# Altium schematic sheet 4_IMU.SchDoc
size A4; SheetNumber: 6; SheetTotal: 7
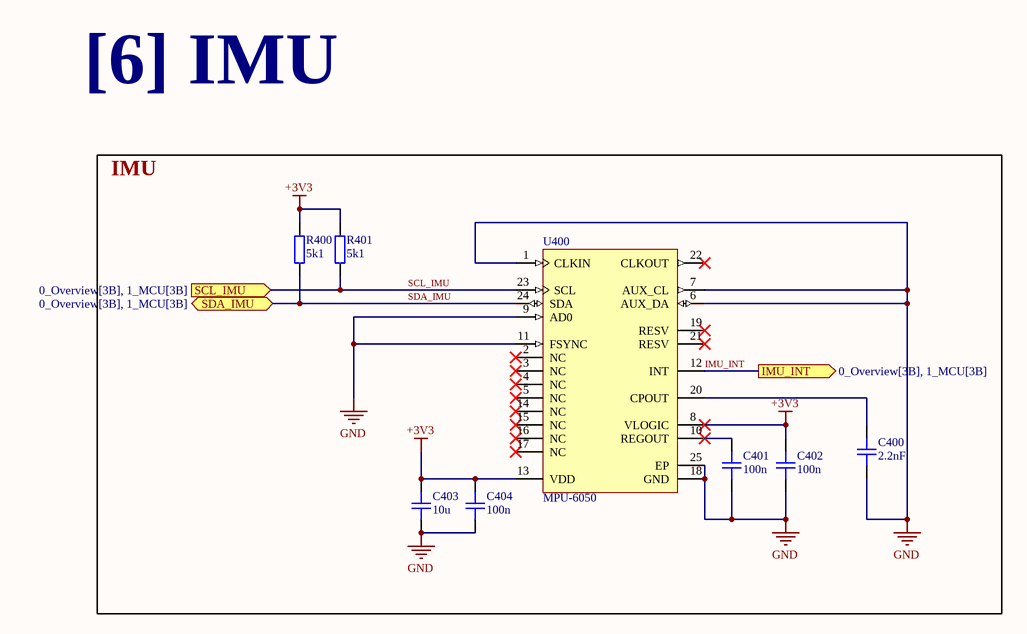
[diagram p0: 4_IMU.SchDoc]

## Parts
C400  2.2nF  [CAP_0603]
C401  100n  [CAP_0603]
C402  100n  [CAP_0603]
C403  10u  [CAP_0805]
C404  100n  [CAP_0603]
R400  5k1  [RES_0603]
R401  5k1  [RES_0603]
U400  MPU-6050  [IS-QFN-24_V]

## Blocks framed on the sheet
IMU: C400-C404 R400 R401 U400

## Ports
IMU_INT (out, see 0_Overview[3B], 1_MCU[3B]), SCL_IMU (in, see 0_Overview[3B], 1_MCU[3B]), SDA_IMU (bidir, see 0_Overview[3B], 1_MCU[3B])

## Nets
+3V3: C402.1 C403.2 C404.1 R400.2 R401.2 U400.8(VLOGIC) U400.13(VDD)
GND: C400.2 C401.2 C402.2 C403.1 C404.2 U400.1(CLKIN) U400.6(AUX_DA) U400.7(AUX_CL) U400.9(AD0) U400.11(FSYNC) U400.18(GND) U400.25(EP)
IMU_INT: U400.12(INT) ; port IMU_INT
SCL_IMU: R401.1 U400.23(SCL) ; port SCL_IMU
SDA_IMU: R400.1 U400.24(SDA) ; port SDA_IMU
NetC400_1: C400.1 U400.20(CPOUT)
NetC401_1: C401.1 U400.10(REGOUT)

Not connected (* = marked no-connect by the designer): U400 2(NC)* 3(NC)* 4(NC)* 5(NC)* 14(NC)* 15(NC)* 16(NC)* 17(NC)* 19(RESV)* 21(RESV)* 22(CLKOUT)*

## Notes on the sheet
- [6] IMU

## Library data of the parts
C400-C402 C404 = CAP_0603: Capacitor SMD 0603; Manufacturer: *; Manufacturer Part Number: *; Distributor Link: *; LCSC: *; Rating: *; Dielectric: *
C403 = CAP_0805: Capacitor SMD 0805; Manufacturer: *; Manufacturer Part Number: *; Distributor Link: *; LCSC: *; Rating: *; Dielectric: *
R400 R401 = RES_0603: Resistor SMD 0603; Manufacturer: *; Manufacturer Part Number: *; Distributor Link: *; LCSC: *
U400 = CMP-1753-00002-2: 3-Axis Gyroscope, Accelerometer and a Digital Motion Processor(TM) (DMP), 2.375 to 3.46 V, -40 to 85 degC, 24-Pin QFN, RoHS, Tape and Reel; Manufacturer: InvenSense; Featured Product: MPU-60506-Axis,IntegratedI²CSolution; Other Names: 1428-1007-2 / MPU6050; Sensor Type: MotionTracking; Online Catalog: MPU-6000™Series; Unit PriceUSD: Digital; Datasheet Version: Rev. 3.3, 05/2012; Category: Sensors,Transducers; Datasheet URL: http://datasheet.octopart.com/MPU-6050-InvenSense-datasheet-14421344.pdf; Family: Multifunction; Standard Package: 5,000; Manufacturer URL: http://www.invensense.com/; Output Type: Digital; Dynamic Catalog: MPU-6000™Series